# Altium project candy-box.PrjPcb
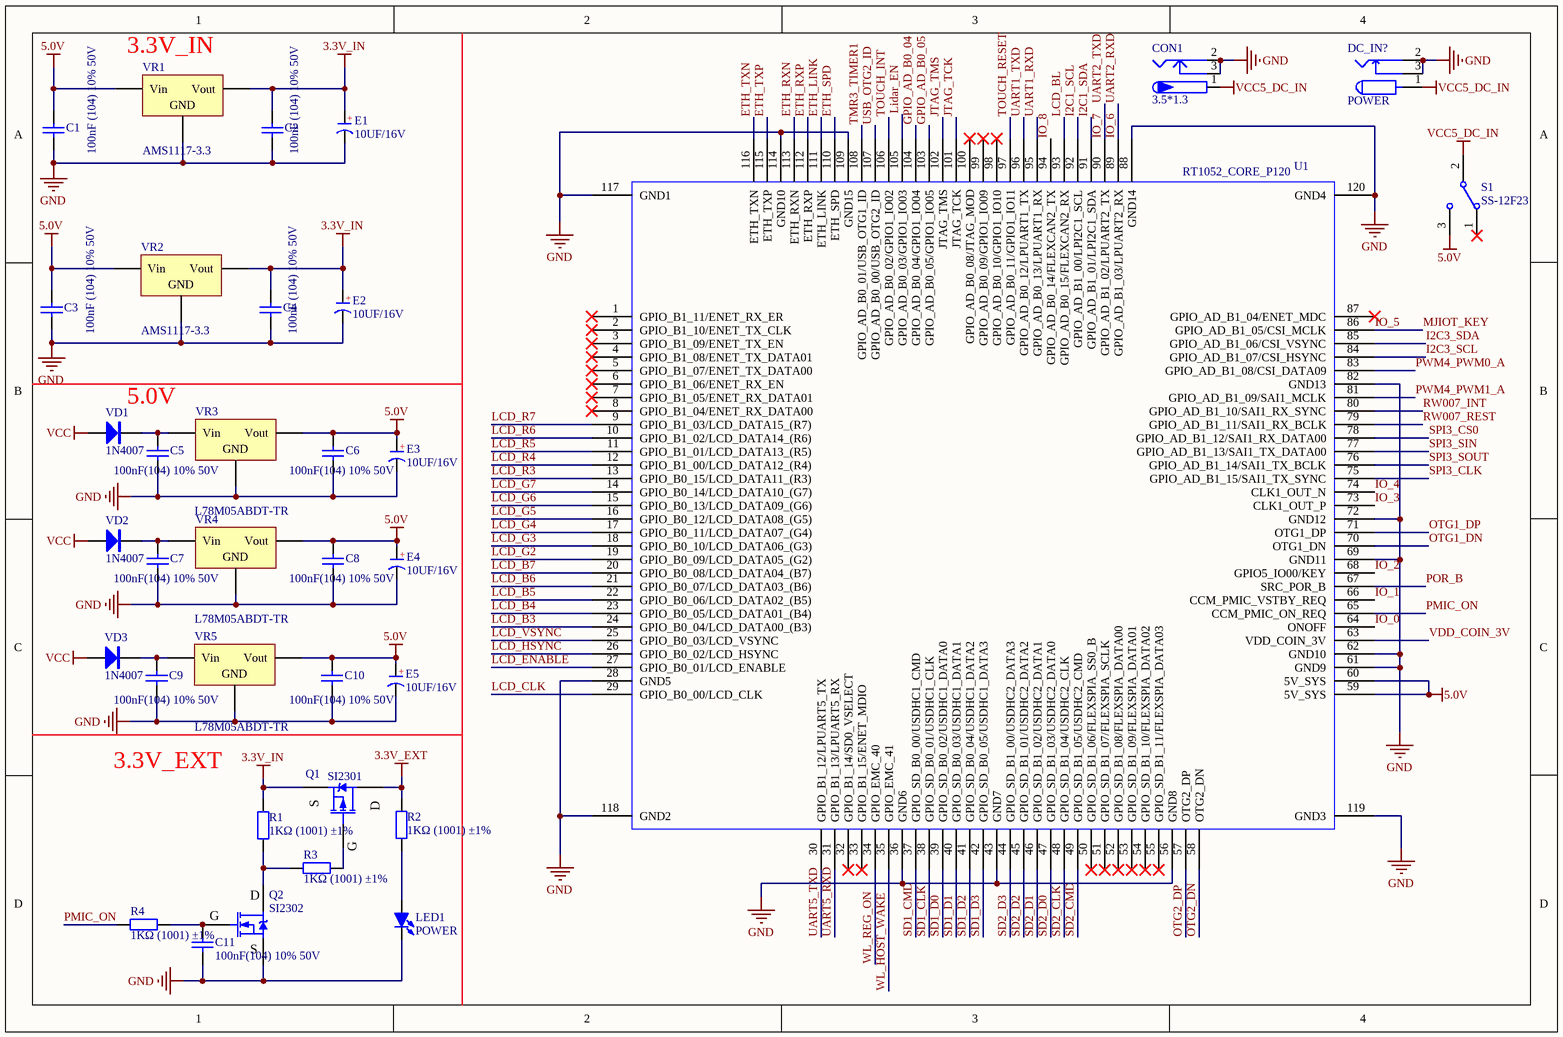
[diagram p0: Sheet1.SchDoc]
3 sheets, 131 parts. Net scope: global (net labels, ports and power ports of the same name join across sheets).
Board file: PCB1.PcbDoc
Sheets:
  Sheet1.SchDoc
  Sheet2.SchDoc
  Sheet3.SchDoc

## Sheet Sheet1.SchDoc
size A4

### Parts
C1  100nF (104) 10% 50V  [0603_C]
C2  100nF (104) 10% 50V  [0603_C]
C3  100nF (104) 10% 50V  [0603_C]
C4  100nF (104) 10% 50V  [0603_C]
C5  100nF(104) 10% 50V  [0805_C]
C6  100nF(104) 10% 50V  [0805_C]
C7  100nF(104) 10% 50V  [0805_C]
C8  100nF(104) 10% 50V  [0805_C]
C9  100nF(104) 10% 50V  [0805_C]
C10  100nF(104) 10% 50V  [0805_C]
C11  100nF(104) 10% 50V  [0805_C]
CON1  3.5*1.3  [DC-005]
DC_IN?  POWER  [DC10B]
E1  10UF/16V  [CAP 1.5*4*8]
E2  10UF/16V  [CAP 1.5*4*8]
E3  10UF/16V  [CAP 1.5*4*8 - GD]
E4  10UF/16V  [CAP 1.5*4*8 - GD]
E5  10UF/16V  [CAP 1.5*4*8 - GD]
LED1  POWER  [LED 3MM-B]
Q1  SI2301  [SOT23-3N]
Q2  SI2302  [SOT23-3N]
R1  1KΩ (1001) ±1%  [0603_R]
R2  1KΩ (1001) ±1%  [0603_R]
R3  1KΩ (1001) ±1%  [0603_R]
R4  1KΩ (1001) ±1%  [0603_R]
S1  SS-12F23  [SS-12F23]
U1  RT1052_CORE_P120  [RT1052_CORE_P120]
VD1  1N4007  [DO-41]
VD2  1N4007  [DO-41]
VD3  1N4007  [DO-41]
VR1  AMS1117-3.3  [SOT-223]
VR2  AMS1117-3.3  [SOT-223]
VR3  L78M05ABDT-TR  [TO-252-2-180]
VR4  L78M05ABDT-TR  [TO-252-2-180]
VR5  L78M05ABDT-TR  [TO-252-2-180]

### Nets
3.3V_EXT: Q1.3(D) R2.2
3.3V_IN: C2.2 C4.2 E1.1(A) E2.1(A) Q1.2(S) R1.2 VR1.2(Vout) VR2.2(Vout)
5.0V: C1.2 C3.2 C6.1 C8.1 C10.1 E3.1(A) E4.1(A) E5.1(A) S1.3 U1.59(5V_SYS) U1.60(5V_SYS) VR1.3(Vin) VR2.3(Vin) VR3.3(Vout) VR4.3(Vout) VR5.3(Vout)
GND: C1.1 C2.1 C3.1 C4.1 C5.2 C6.2 C7.2 C8.2 C9.2 C10.2 C11.2 CON1.2 CON1.3 DC_IN?.2 DC_IN?.3 E1.2(K) E2.2(K) E3.2(K) E4.2(K) E5.2(K) LED1.2(K) Q2.2(S) U1.28(GND5) U1.36(GND6) U1.43(GND7) U1.56(GND8) U1.61(GND9) U1.62(GND10) U1.69(GND11) U1.72(GND12) U1.82(GND13) U1.88(GND14) U1.109(GND15) U1.114(GND10) U1.117(GND1) U1.118(GND2) U1.119(GND3) U1.120(GND4) VR1.1(GND) VR2.1(GND) VR3.2(GND) VR4.2(GND) VR5.2(GND)
VCC: VD1.1(A) VD2.1(A) VD3.1(A)
VCC5_DC_IN: CON1.1 DC_IN?.1 S1.2
ETH_LINK: U1.111(ETH_LINK)
ETH_RXN: U1.113(ETH_RXN)
ETH_RXP: U1.112(ETH_RXP)
ETH_SPD: U1.110(ETH_SPD)
ETH_TXN: U1.116(ETH_TXN)
ETH_TXP: U1.115(ETH_TXP)
GPIO_AD_B0_04: U1.104(GPIO_AD_B0_04/GPIO1_IO04)
GPIO_AD_B0_05: U1.103(GPIO_AD_B0_05/GPIO1_IO05)
I2C1_SCL: U1.92(GPIO_AD_B1_00/LPI2C1_SCL)
I2C1_SDA: U1.91(GPIO_AD_B1_01/LPI2C1_SDA)
I2C3_SCL: U1.84(GPIO_AD_B1_07/CSI_HSYNC)
I2C3_SDA: U1.85(GPIO_AD_B1_06/CSI_VSYNC)
IO_0: U1.64(ONOFF)
IO_1: U1.66(CCM_PMIC_VSTBY_REQ)
IO_2: U1.68(GPIO5_IO00/KEY)
IO_3: U1.73(CLK1_OUT_P)
IO_4: U1.74(CLK1_OUT_N)
IO_5: U1.86(GPIO_AD_B1_05/CSI_MCLK)  [also labelled MJIOT_KEY]
IO_6: U1.89(GPIO_AD_B1_03/LPUART2_RX)  [also labelled UART2_RXD]
IO_7: U1.90(GPIO_AD_B1_02/LPUART2_TX)  [also labelled UART2_TXD]
IO_8: U1.94(GPIO_AD_B0_14/FLEXCAN2_TX)
JTAG_TCK: U1.101(JTAG_TCK)
JTAG_TMS: U1.102(JTAG_TMS)
LCD_B3: U1.24(GPIO_B0_04/LCD_DATA00_(B3))
LCD_B4: U1.23(GPIO_B0_05/LCD_DATA01_(B4))
LCD_B5: U1.22(GPIO_B0_06/LCD_DATA02_(B5))
LCD_B6: U1.21(GPIO_B0_07/LCD_DATA03_(B6))
LCD_B7: U1.20(GPIO_B0_08/LCD_DATA04_(B7))
LCD_BL: U1.93(GPIO_AD_B0_15/FLEXCAN2_RX)
LCD_CLK: U1.29(GPIO_B0_00/LCD_CLK)
LCD_ENABLE: U1.27(GPIO_B0_01/LCD_ENABLE)
LCD_G2: U1.19(GPIO_B0_09/LCD_DATA05_(G2))
LCD_G3: U1.18(GPIO_B0_10/LCD_DATA06_(G3))
LCD_G4: U1.17(GPIO_B0_11/LCD_DATA07_(G4))
LCD_G5: U1.16(GPIO_B0_12/LCD_DATA08_(G5))
LCD_G6: U1.15(GPIO_B0_13/LCD_DATA09_(G6))
LCD_G7: U1.14(GPIO_B0_14/LCD_DATA10_(G7))
LCD_HSYNC: U1.26(GPIO_B0_02/LCD_HSYNC)
LCD_R3: U1.13(GPIO_B0_15/LCD_DATA11_(R3))
LCD_R4: U1.12(GPIO_B1_00/LCD_DATA12_(R4))
LCD_R5: U1.11(GPIO_B1_01/LCD_DATA13_(R5))
LCD_R6: U1.10(GPIO_B1_02/LCD_DATA14_(R6))
LCD_R7: U1.9(GPIO_B1_03/LCD_DATA15_(R7))
LCD_VSYNC: U1.25(GPIO_B0_03/LCD_VSYNC)
Lidar_EN: U1.105(GPIO_AD_B0_03/GPIO1_IO03)
OTG1_DN: U1.70(OTG1_DN)
OTG1_DP: U1.71(OTG1_DP)
OTG2_DN: U1.58(OTG2_DN)
OTG2_DP: U1.57(OTG2_DP)
PMIC_ON: R4.2 U1.65(CCM_PMIC_ON_REQ)
POR_B: U1.67(SRC_POR_B)
PWM4_PWM0_A: U1.83(GPIO_AD_B1_08/CSI_DATA09)
PWM4_PWM1_A: U1.81(GPIO_AD_B1_09/SAI1_MCLK)
RW007_INT: U1.80(GPIO_AD_B1_10/SAI1_RX_SYNC)
RW007_REST: U1.79(GPIO_AD_B1_11/SAI1_RX_BCLK)
SD1_CLK: U1.38(GPIO_SD_B0_01/USDHC1_CLK)
SD1_CMD: U1.37(GPIO_SD_B0_00/USDHC1_CMD)
SD1_D0: U1.39(GPIO_SD_B0_02/USDHC1_DATA0)
SD1_D1: U1.40(GPIO_SD_B0_03/USDHC1_DATA1)
SD1_D2: U1.41(GPIO_SD_B0_04/USDHC1_DATA2)
SD1_D3: U1.42(GPIO_SD_B0_05/USDHC1_DATA3)
SD2_CLK: U1.48(GPIO_SD_B1_04/USDHC2_CLK)
SD2_CMD: U1.49(GPIO_SD_B1_05/USDHC2_CMD)
SD2_D0: U1.47(GPIO_SD_B1_03/USDHC2_DATA0)
SD2_D1: U1.46(GPIO_SD_B1_02/USDHC2_DATA1)
SD2_D2: U1.45(GPIO_SD_B1_01/USDHC2_DATA2)
SD2_D3: U1.44(GPIO_SD_B1_00/USDHC2_DATA3)
SPI3_CLK: U1.75(GPIO_AD_B1_15/SAI1_TX_SYNC)
SPI3_CS0: U1.78(GPIO_AD_B1_12/SAI1_RX_DATA00)
SPI3_SIN: U1.77(GPIO_AD_B1_13/SAI1_TX_DATA00)
SPI3_SOUT: U1.76(GPIO_AD_B1_14/SAI1_TX_BCLK)
TMR3_TIMER1: U1.108(GPIO_AD_B0_01/USB_OTG1_ID)
TOUCH_INT: U1.106(GPIO_AD_B0_02/GPIO1_IO02)
TOUCH_RESET: U1.97(GPIO_AD_B0_11/GPIO1_IO11)
UART1_RXD: U1.95(GPIO_AD_B0_13/LPUART1_RX)
UART1_TXD: U1.96(GPIO_AD_B0_12/LPUART1_TX)
UART5_RXD: U1.31(GPIO_B1_13/LPUART5_RX)
UART5_TXD: U1.30(GPIO_B1_12/LPUART5_TX)
USB_OTG2_ID: U1.107(GPIO_AD_B0_00/USB_OTG2_ID)
VDD_COIN_3V: U1.63(VDD_COIN_3V)
WL_HOST_WAKE: U1.35(GPIO_EMC_41)
WL_REG_ON: U1.34(GPIO_EMC_40)
NetC5_1: C5.1 VD1.2(K) VR3.1(Vin)
NetC7_1: C7.1 VD2.2(K) VR4.1(Vin)
NetC9_1: C9.1 VD3.2(K) VR5.1(Vin)
NetC11_1: C11.1 Q2.1(G) R4.1
NetLED1_1: LED1.1(A) R2.1
NetQ1_1: Q1.1(G) R3.1
NetQ2_3: Q2.3(D) R1.1 R3.2

Not connected (* = marked no-connect by the designer): S1 1*; U1 1(GPIO_B1_11/ENET_RX_ER)* 2(GPIO_B1_10/ENET_TX_CLK)* 3(GPIO_B1_09/ENET_TX_EN)* 4(GPIO_B1_08/ENET_TX_DATA01)* 5(GPIO_B1_07/ENET_TX_DATA00)* 6(GPIO_B1_06/ENET_RX_EN)* 7(GPIO_B1_05/ENET_RX_DATA01)* 8(GPIO_B1_04/ENET_RX_DATA00)* 32(GPIO_B1_14/SD0_VSELECT)* 33(GPIO_B1_15/ENET_MDIO)* 50(GPIO_SD_B1_06/FLEXSPIA_SS0_B)* 51(GPIO_SD_B1_07/FLEXSPIA_SCLK)* 52(GPIO_SD_B1_08/FLEXSPIA_DATA00)* 53(GPIO_SD_B1_09/FLEXSPIA_DATA01)* 54(GPIO_SD_B1_10/FLEXSPIA_DATA02)* 55(GPIO_SD_B1_11/FLEXSPIA_DATA03)* 87(GPIO_AD_B1_04/ENET_MDC)* 98(GPIO_AD_B0_10/GPIO1_IO10)* 99(GPIO_AD_B0_09/GPIO1_IO09)* 100(GPIO_AD_B0_08/JTAG_MOD)*

### Notes on the sheet
- (near VR1) 3.3V_IN
- 5.0V
- 3.3V_EXT
- Title
- Size:
- Date:
- A4
- Number:
- Time:
- Revision:
- Sheet
- of
- File:
- (in symbol C-CAP) +

### Library data of the parts
C1-C4 = 0603 100nF (104) 10% 50V: 贴片电容; ComponentLink1Description: 供应商链接; ComponentLink1URL: http://www.szlcsc.com/product/details_15331.html; Package: 0603; Supplier: LC; SuppliersPartNumber: C14663
C5-C11 = 0805 100nF(104) 10% 50V: 贴片电容; ComponentLink1Description: 供应商链接; ComponentLink1URL: http://www.szlcsc.com/product/details_50686.html; Package: 0805; Supplier: LC; SuppliersPartNumber: C49678
CON1 = P-DC: 低压电源接口; BOM名称: DC电源接口; 版权归属: 源创客; 学习资源: www.ooocke.com
DC_IN? = POW
E1-E5 = C-CAP: 直插电解电容; 版权归属: 源创客; BOM名称: 直插电解电容; 学习资源: www.ooocke.com
LED1 = LED-3MM: 插件LED; 版权归属: 源创客; BOM名称: 插件LED; 学习资源: www.ooocke.com
Q1 = SI2301: P沟道场效应管; 版权归属: 源创客; BOM名称: P沟道场效应管; 学习资源: www.ooocke.com
Q2 = SI2302: N沟道场效应管; 版权归属: 源创客; BOM名称: N沟道场效应管; 学习资源: www.ooocke.com
R1-R4 = 0603 1KΩ (1001) 1%: 贴片电阻; ComponentLink1Description: 供应商链接; ComponentLink1URL: http://www.szlcsc.com/product/details_21904.html; Package: 0603; Supplier: LC; SuppliersPartNumber: C21190
S1 = SSW-1P: 1路波动开关; BOM名称: 波动开关; 版权归属: 源创客; 学习资源: www.ooocke.com
VD1-VD3 = 1N4007: 整流二极管; 版权归属: 源创客; BOM名称: 整流二极管; 学习资源: www.ooocke.com
VR1 VR2 = SOT-223 AMS1117-3.3: 低压差线性稳压(LDO); ComponentLink1Description: 供应商链接; ComponentLink1URL: http://www.szlcsc.com/product/details_6652.html; Package: SOT-223; Supplier: LC; SuppliersPartNumber: C6186
VR3-VR5 = TO-252-2 L78M05ABDT-TR: 低压差线性稳压(LDO); ComponentLink1Description: 供应商链接; ComponentLink1URL: http://www.szlcsc.com/product/details_59107.html; Package: TO-252-2; Supplier: LC; SuppliersPartNumber: C58069
U1 = RT1052_CORE_P120: PCB DECAL: *; Source_Path: *; Value: *

## Sheet Sheet2.SchDoc
size A4
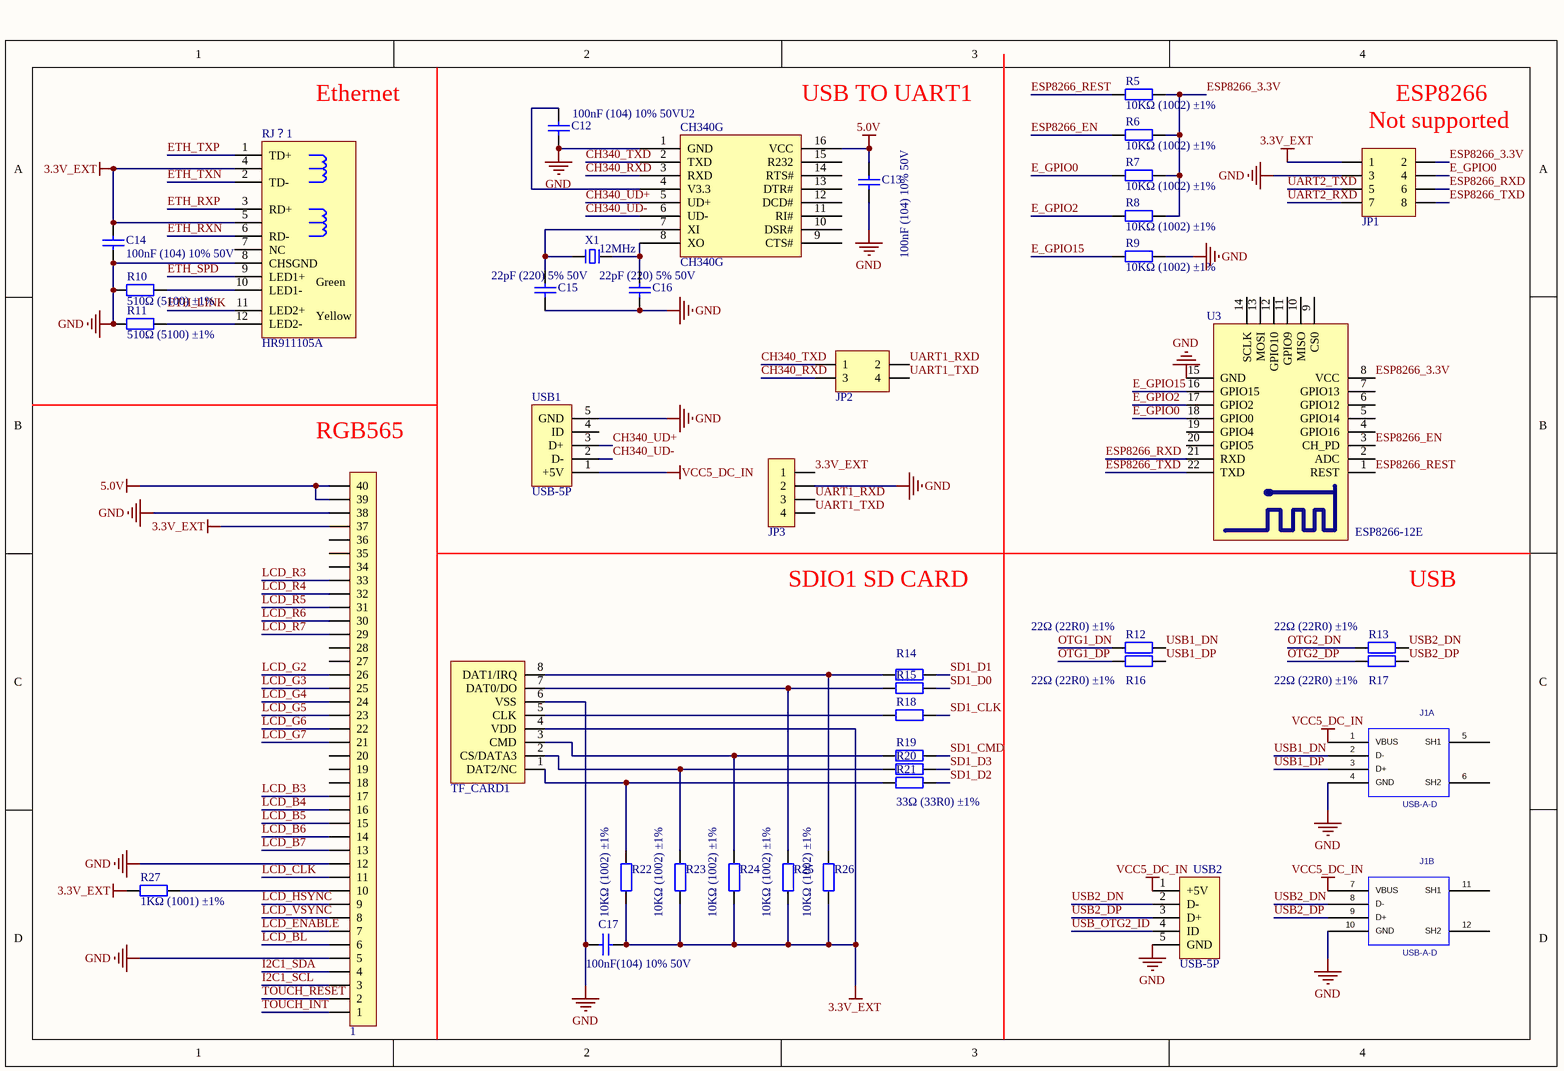
[diagram p1: Sheet2.SchDoc]

### Parts
1  FPC1.0-40P  [FPC0.5 2H-S-W-40P]  (value not drawn)
C12  100nF (104) 10% 50V  [0603_C]
C13  100nF (104) 10% 50V  [0603_C]
C14  100nF (104) 10% 50V  [0603_C]
C15  22pF (220) 5% 50V  [0603_C]
C16  22pF (220) 5% 50V  [0603_C]
C17  100nF(104) 10% 50V  [0805_C]
J1  value USB-A-D  [USB-A-D]  (hidden comment: USB-A-D_0)  (parts A,B of 2)
JP1  Header 4X2  [HDR-4X2]  (value not drawn)
JP2  Header2X2  [HDR-2X2]  (value not drawn)
JP3  HDR-1X4  [HDR-1X4_M]  (value not drawn)
R5  10KΩ (1002) ±1%  [0603_R]
R6  10KΩ (1002) ±1%  [0603_R]
R7  10KΩ (1002) ±1%  [0603_R]
R8  10KΩ (1002) ±1%  [0603_R]
R9  10KΩ (1002) ±1%  [0603_R]
R10  510Ω (5100) ±1%  [0603_R]
R11  510Ω (5100) ±1%  [0603_R]
R12  22Ω (22R0) ±1%  [0603_R]
R13  22Ω (22R0) ±1%  [0603_R]
R14  33Ω (33R0) ±1%  [0603_R]  (value not drawn)
R15  33Ω (33R0) ±1%  [0603_R]  (value not drawn)
R16  22Ω (22R0) ±1%  [0603_R]
R17  22Ω (22R0) ±1%  [0603_R]
R18  33Ω (33R0) ±1%  [0603_R]  (value not drawn)
R19  33Ω (33R0) ±1%  [0603_R]  (value not drawn)
R20  33Ω (33R0) ±1%  [0603_R]  (value not drawn)
R21  33Ω (33R0) ±1%  [0603_R]
R22  10KΩ (1002) ±1%  [0603_R]
R23  10KΩ (1002) ±1%  [0603_R]
R24  10KΩ (1002) ±1%  [0603_R]
R25  10KΩ (1002) ±1%  [0603_R]
R26  10KΩ (1002) ±1%  [0603_R]
R27  1KΩ (1001) ±1%  [0603_R]
RJ？1  HR911105A  [RJ-45A12]
TF_CARD1  SD-MICRO-TF  [SD-MICRO-TF]  (value not drawn)
U2  CH340G  [SOIC-16_150mil]
U3  ESP8266-12E  [ESP_12E]
USB1  USB-5P  [USB-MINI-A]
USB2  USB-5P  [USB-MINI-A]
X1  12MHz  [XTAL-49S DIP]

### Nets
3.3V_EXT: 1.37 C14.2 C17.1 JP1.1 JP3.1 R22.1 R23.1 R24.1 R25.1 R26.1 R27.2 RJ？1.4 RJ？1.5 TF_CARD1.4(VDD)
5.0V: 1.39 1.40 C13.1 U2.16(VCC)
GND: 1.5 1.12 1.38 C12.1 C13.2 C14.1 C15.2 C16.2 C17.2 J1.4(GND) J1.10(GND) JP1.3 JP3.2 R9.1 R10.1 R11.1 RJ？1.8(CHSGND) TF_CARD1.6(VSS) U2.1(GND) U3.15(GND) USB1.5(GND) USB2.5(GND)
VCC5_DC_IN: J1.1(VBUS) J1.7(VBUS) USB1.1(+5V) USB2.1(+5V)
CH340_RXD: JP2.3 U2.3(RXD)
CH340_TXD: JP2.1 U2.2(TXD)
CH340_UD+: U2.5(UD+) USB1.3(D+)
CH340_UD-: U2.6(UD-) USB1.2(D-)
E_GPIO0: JP1.4 R7.1 U3.18(GPIO0)
E_GPIO2: R8.1 U3.17(GPIO2)
E_GPIO15: R9.2 U3.16(GPIO15)
ESP8266_3.3V: JP1.2 R5.2 R6.2 R7.2 R8.2 U3.8(VCC)
ESP8266_EN: R6.1 U3.3(CH_PD)
ESP8266_REST: R5.1 U3.1(REST)
ESP8266_RXD: JP1.6 U3.21(RXD)
ESP8266_TXD: JP1.8 U3.22(TXD)
ETH_LINK: RJ？1.11(LED2+)
ETH_RXN: RJ？1.6(RD-)
ETH_RXP: RJ？1.3(RD+)
ETH_SPD: RJ？1.9(LED1+)
ETH_TXN: RJ？1.2(TD-)
ETH_TXP: RJ？1.1(TD+)
I2C1_SCL: 1.3
I2C1_SDA: 1.4
LCD_B3: 1.17
LCD_B4: 1.16
LCD_B5: 1.15
LCD_B6: 1.14
LCD_B7: 1.13
LCD_BL: 1.6
LCD_CLK: 1.11
LCD_ENABLE: 1.7
LCD_G2: 1.26
LCD_G3: 1.25
LCD_G4: 1.24
LCD_G5: 1.23
LCD_G6: 1.22
LCD_G7: 1.21
LCD_HSYNC: 1.9
LCD_R3: 1.33
LCD_R4: 1.32
LCD_R5: 1.31
LCD_R6: 1.30
LCD_R7: 1.29
LCD_VSYNC: 1.8
OTG1_DN: R12.1
OTG1_DP: R16.1
OTG2_DN: R13.1
OTG2_DP: R17.1
SD1_CLK: R18.2
SD1_CMD: R19.2
SD1_D0: R15.2
SD1_D1: R14.2
SD1_D2: R21.2
SD1_D3: R20.2
TOUCH_INT: 1.1
TOUCH_RESET: 1.2
UART1_RXD: JP2.2 JP3.3
UART1_TXD: JP2.4 JP3.4
UART2_RXD: JP1.7  [project net IO_6]
UART2_TXD: JP1.5  [project net IO_7]
USB1_DN: J1.2(D-) R12.2
USB1_DP: J1.3(D+) R16.2
USB2_DN: J1.8(D-) R13.2 USB2.2(D-)
USB2_DP: J1.9(D+) R17.2 USB2.3(D+)
USB_OTG2_ID: USB2.4(ID)
Net1_10: 1.10 R27.1
NetC12_2: C12.2 U2.4(V3.3)
NetC15_1: C15.1 U2.7(XI) X1.1
NetC16_1: C16.1 U2.8(XO) X1.2
NetR10_2: R10.2 RJ？1.10(LED1-)
NetR11_2: R11.2 RJ？1.12(LED2-)
NetR14_1: R14.1 R26.2 TF_CARD1.8(DAT1/IRQ)
NetR15_1: R15.1 R25.2 TF_CARD1.7(DAT0/DO)
NetR18_1: R18.1 TF_CARD1.5(CLK)
NetR19_1: R19.1 R24.2 TF_CARD1.3(CMD)
NetR20_1: R20.1 R23.2 TF_CARD1.2(CS/DATA3)
NetR21_1: R21.1 R22.2 TF_CARD1.1(DAT2/NC)

Not connected (* = marked no-connect by the designer): 1 18 19 20 27 28 34 35 36; J1 5(SH1) 6(SH2) 11(SH1) 12(SH2); RJ？1 7(NC); U2 9(CTS#) 10(DSR#) 11(RI#) 12(DCD#) 13(DTR#) 14(RTS#) 15(R232); U3 2(ADC) 4(GPIO16) 5(GPIO14) 6(GPIO12) 7(GPIO13) 9(CS0) 10(MISO) 11(GPIO9) 12(GPIO10) 13(MOSI) 14(SCLK) 19(GPIO4) 20(GPIO5); USB1 4(ID)

### Notes on the sheet
- Ethernet
- (near U2) USB TO UART1
- (near JP1) Not supported
- ESP8266
- (near 1) RGB565
- SDIO1 SD CARD
- USB
- Title
- Size:
- Date:
- A4
- Number:
- Time:
- Revision:
- Sheet
- of
- File:
- (in symbol HR911105A) Green; Yellow

### Library data of the parts
1 = FPC-40P: FPC连接器; 版权归属: 源创客; BOM名称: FPC连接器; 学习资源: www.ooocke.com
C12-C14 = 0603 100nF (104) 10% 50V: 贴片电容; ComponentLink1Description: 供应商链接; ComponentLink1URL: http://www.szlcsc.com/product/details_15331.html; Package: 0603; Supplier: LC; SuppliersPartNumber: C14663
C15 C16 = 0805 22pF (220) 5% 50V: 贴片电容; ComponentLink1Description: 供应商链接; ComponentLink1URL: http://www.szlcsc.com/product/details_2156.html; Package: 0805; Supplier: LC; SuppliersPartNumber: C1804
C17 = 0805 100nF(104) 10% 50V: 贴片电容; ComponentLink1Description: 供应商链接; ComponentLink1URL: http://www.szlcsc.com/product/details_50686.html; Package: 0805; Supplier: LC; SuppliersPartNumber: C49678
J1 = USB-A-D_0: Source_Path: D:\NXP_RT1050\RT1050_MB_PRO\SCH\IMXRT1052_MB_PRO_0313.DSN; PCB DECAL: USB-A-D
JP1 = Header 4X2: 4*2P接插件; 版权归属: 源创客; BOM名称: 4*2P接插件; 学习资源: www.ooocke.com
JP2 = Header 2X2: 2*2P接插件; 版权归属: 源创客; BOM名称: 2*2P接插件; 学习资源: www.ooocke.com
JP3 = Header 4: 4P接插件; 版权归属: 源创客; BOM名称: 4P接插件; 学习资源: www.ooocke.com
R5-R9 R22-R26 = 0603 10KΩ (1002) 1%: 贴片电阻; ComponentLink1Description: 供应商链接; ComponentLink1URL: http://www.szlcsc.com/product/details_26547.html; Package: 0603; Supplier: LC; SuppliersPartNumber: C25804
R10 R11 = 0603 510Ω (5100) 1%: 贴片电阻; ComponentLink1Description: 供应商链接; ComponentLink1URL: http://www.szlcsc.com/product/details_23920.html; Package: 0603; Supplier: LC; SuppliersPartNumber: C23193
R12 R13 R16 R17 = 0603 22Ω (22R0) 1%: 贴片电阻; ComponentLink1Description: 供应商链接; ComponentLink1URL: http://www.szlcsc.com/product/details_24078.html; Package: 0603; Supplier: LC; SuppliersPartNumber: C23345
R14 R15 R18-R21 = 0603 33Ω (33R0) 1%: 贴片电阻; ComponentLink1Description: 供应商链接; ComponentLink1URL: http://www.szlcsc.com/product/details_23867.html; Package: 0603; Supplier: LC; SuppliersPartNumber: C23140
R27 = 0603 1KΩ (1001) 1%: 贴片电阻; ComponentLink1Description: 供应商链接; ComponentLink1URL: http://www.szlcsc.com/product/details_21904.html; Package: 0603; Supplier: LC; SuppliersPartNumber: C21190
RJ？1 = HR911105A: 带灯以太网接口; 版权归属: 源创客; BOM名称: 带灯以太网接口; 学习资源: www.ooocke.com
TF_CARD1 = SD-MICRO-TF: SD,MICRO,TF
U2 = CH340G_[C14267]: USB; ComponentLink1Description: 供应商链接; ComponentLink1URL: http://www.szlcsc.com/product/details_14927.html; Package: SOIC-16_150mil; Supplier: LC; SuppliersPartNumber: C14267
U3 = ESP8266-12E: 串口 WIFI模块，ESP-12E; BOM名称: WIFI模块; 版权归属: 源创客; 学习资源: www.ooocke.com
USB1 USB2 = USB-5P: 微型USB母座; 版权归属: 源创客; BOM名称: 微型USB母座; 学习资源: www.ooocke.com
X1 = XTAL-2: 2脚晶振; 版权归属: 源创客; BOM名称: 2脚晶振; 学习资源: www.ooocke.com

## Sheet Sheet3.SchDoc: https://github.com/balanceTWK/candy-box
size A4; Author: https://github.com/balanceTWK/candy-box; DrawnBy: https://github.com/balanceTWK/candy-box
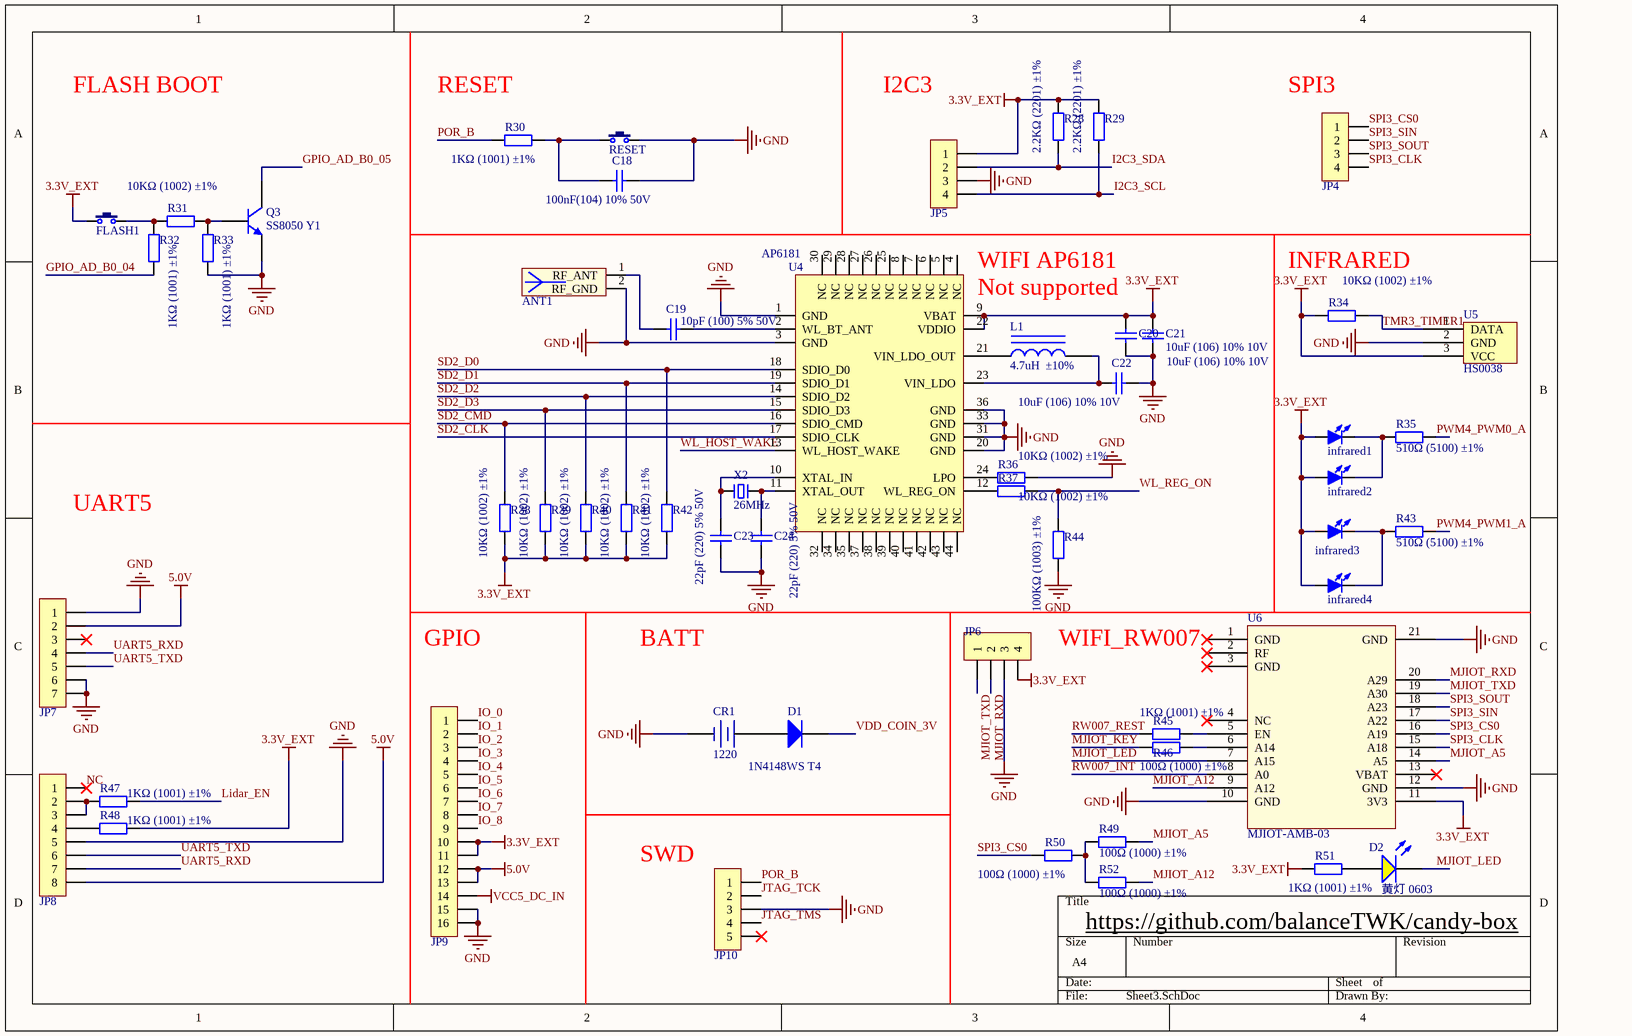
[diagram p2: Sheet3.SchDoc]

### Parts
ANT1  ANT-2.4G  [ANT-2.4G]  (value not drawn)
C18  100nF(104) 10% 50V  [0805_C]
C19  10pF (100) 5% 50V  [0603_C]
C20  10uF (106) 10% 10V  [0603_C]
C21  10uF (106) 10% 10V  [0603_C]
C22  10uF (106) 10% 10V  [0603_C]
C23  22pF (220) 5% 50V  [0603_C]
C24  22pF (220) 5% 50V  [0603_C]
CR1  1220  [CR1220_B]
D1  1N4148WS T4  [SOD-323]
D2  黄灯 0603  [0603_LED_S1]
FLASH1  6x6x5  [TSW DIP-6*6*6_V]  (value not drawn)
infrared1  红色  [LED 3MM-R]  (value not drawn)
infrared2  红色  [LED 3MM-R]  (value not drawn)
infrared3  红色  [LED 3MM-R]  (value not drawn)
infrared4  红色  [LED 3MM-R]  (value not drawn)
JP4  HDR-1X4  [HDR-1X4]  (value not drawn)
JP5  HDR-1X4  [HDR-1X4_M]  (value not drawn)
JP6  HDR-1X4  [HDR-1X4]  (value not drawn)
JP7  HDR-1X7  [HDR-1X7_M]  (value not drawn)
JP8  HDR-1X8  [PH2.0 D-W-8P]  (value not drawn)
JP9  HDR-1X16  [HDR-1X16]  (value not drawn)
JP10  HDR-1X5  [XH2.54-5P]  (value not drawn)
L1  4.7uH  ±10%  [1206_L]
Q3  SS8050 Y1  [SOT-23(SOT-23-3)]
R28  2.2KΩ (2201) ±1%  [0603_R]
R29  2.2KΩ (2201) ±1%  [0603_R]
R30  1KΩ (1001) ±1%  [0603_R]
R31  10KΩ (1002) ±1%  [0603_R]
R32  1KΩ (1001) ±1%  [0603_R]
R33  1KΩ (1001) ±1%  [0603_R]
R34  10KΩ (1002) ±1%  [0603_R]
R35  510Ω (5100) ±1%  [0603_R]
R36  10KΩ (1002) ±1%  [0603_R]
R37  10KΩ (1002) ±1%  [0603_R]
R38  10KΩ (1002) ±1%  [0603_R]
R39  10KΩ (1002) ±1%  [0603_R]
R40  10KΩ (1002) ±1%  [0603_R]
R41  10KΩ (1002) ±1%  [0603_R]
R42  10KΩ (1002) ±1%  [0603_R]
R43  510Ω (5100) ±1%  [0603_R]
R44  100KΩ (1003) ±1%  [0603_R]
R45  1KΩ (1001) ±1%  [0603_R]
R46  100Ω (1000) ±1%  [0603_R]
R47  1KΩ (1001) ±1%  [0603_R]
R48  1KΩ (1001) ±1%  [0603_R]
R49  100Ω (1000) ±1%  [0603_R]
R50  100Ω (1000) ±1%  [0603_R]
R51  1KΩ (1001) ±1%  [0603_R]
R52  100Ω (1000) ±1%  [0603_R]
RESET  6x6x5  [TSW DIP-6*6*6_V]  (value not drawn)
U4  AP6181  [QFN-44]
U5  HS0038  [HS0038]
U6  MJIOT-AMB-03  [20PIN-MODULE-PLATFORM_DEBUG-01]
X2  26MHz  [XTAL-49S DIP]

### Nets
3.3V_EXT: C20.2 C21.2 FLASH1.1 infrared1.1(A) infrared2.1(A) infrared3.1(A) infrared4.1(A) JP5.1 JP6.4 JP9.10 JP9.11 R28.2 R29.2 R34.2 R38.1 R39.1 R40.1 R41.1 R42.1 R48.2 R51.1 U4.9(VBAT) U4.22(VDDIO) U5.3(VCC) U6.11(3V3)
5.0V: JP7.2 JP8.8 JP9.12 JP9.13
GND: ANT1.2(RF_GND) C18.2 C20.1 C21.1 C22.2 C23.2 C24.2 CR1.2(DC-) JP5.3 JP6.3 JP7.1 JP7.6 JP7.7 JP8.5 JP9.15 JP9.16 JP10.3 Q3.2(E) R33.1 R36.1 R44.1 RESET.2 U4.1(GND) U4.3(GND) U4.20(GND) U4.31(GND) U4.33(GND) U4.36(GND) U5.2(GND) U6.10(GND) U6.12(GND) U6.21(GND)
VCC5_DC_IN: JP9.14
GPIO_AD_B0_04: R32.1
GPIO_AD_B0_05: Q3.3(C)
I2C3_SCL: JP5.4 R29.1
I2C3_SDA: JP5.2 R28.1
IO_0: JP9.1
IO_1: JP9.2
IO_2: JP9.3
IO_3: JP9.4
IO_4: JP9.5
IO_5: JP9.6 R46.1  [also labelled MJIOT_KEY]
IO_6: JP9.7
IO_7: JP9.8
IO_8: JP9.9
JTAG_TCK: JP10.2
JTAG_TMS: JP10.4
Lidar_EN: R47.2
MJIOT_A5: R49.2 U6.14(A5)
MJIOT_A12: R52.2 U6.9(A12)
MJIOT_LED: D2.K U6.7(A15)
MJIOT_RXD: JP6.2 U6.20(A29)
MJIOT_TXD: JP6.1 U6.19(A30)
NC: JP8.1
POR_B: JP10.1 R30.2
PWM4_PWM0_A: R35.2
PWM4_PWM1_A: R43.2
RW007_INT: U6.8(A0)
RW007_REST: R45.1
SD2_CLK: U4.17(SDIO_CLK)
SD2_CMD: R38.2 U4.16(SDIO_CMD)
SD2_D0: R42.2 U4.18(SDIO_D0)
SD2_D1: R41.2 U4.19(SDIO_D1)
SD2_D2: R40.2 U4.14(SDIO_D2)
SD2_D3: R39.2 U4.15(SDIO_D3)
SPI3_CLK: JP4.4 U6.15(A18)
SPI3_CS0: JP4.1 R50.1 U6.16(A19)
SPI3_SIN: JP4.2 U6.17(A22)
SPI3_SOUT: JP4.3 U6.18(A23)
TMR3_TIMER1: R34.1 U5.1(DATA)
UART5_RXD: JP7.4 JP8.7
UART5_TXD: JP7.5 JP8.6
VDD_COIN_3V: D1.2(K)
WL_HOST_WAKE: U4.13(WL_HOST_WAKE)
WL_REG_ON: R37.1 R44.2
NetANT1_1: ANT1.1(RF_ANT) C19.1
NetC18_1: C18.1 R30.1 RESET.1
NetC19_2: C19.2 U4.2(WL_BT_ANT)
NetC22_1: C22.1 L1.2 U4.23(VIN_LDO)
NetC23_1: C23.1 U4.10(XTAL_IN) X2.1
NetC24_1: C24.1 U4.11(XTAL_OUT) X2.2
NetCR1_1: CR1.1(DC+) D1.1(A)
NetD2_A: D2.A R51.2
NetFLASH1_2: FLASH1.2 R31.1 R32.2
Netinfrared1_2: infrared1.2(K) infrared2.2(K) R35.1
Netinfrared3_2: infrared3.2(K) infrared4.2(K) R43.1
NetJP8_2: JP8.2 JP8.3 R47.1
NetJP8_4: JP8.4 R48.1
NetL1_1: L1.1 U4.21(VIN_LDO_OUT)
NetQ3_1: Q3.1(B) R31.2 R33.2
NetR36_2: R36.2 U4.24(LPO)
NetR37_2: R37.2 U4.12(WL_REG_ON)
NetR45_2: R45.2 U6.5(EN)
NetR46_2: R46.2 U6.6(A14)
NetR49_1: R49.1 R50.2 R52.1

Not connected (* = marked no-connect by the designer): JP7 3*; JP10 5*; U4 4(NC) 5(NC) 6(NC) 7(NC) 8(NC) 25(NC) 26(NC) 27(NC) 28(NC) 29(NC) 30(NC) 32(NC) 34(NC) 35(NC) 37(NC) 38(NC) 39(NC) 40(NC) 41(NC) 42(NC) 43(NC) 44(NC); U6 1(GND)* 2(RF)* 3(GND)* 4(NC)* 13(VBAT)*

### Notes on the sheet
- FLASH BOOT
- (near R30) RESET
- I2C3
- (near JP4) SPI3
- (near U4) WIFI AP6181
- (near U4) Not supported
- (near R34) INFRARED
- UART5
- GPIO
- BATT
- (near JP6) WIFI_RW007
- SWD
- https://github.com/balanceTWK/candy-box

### Library data of the parts
ANT1 = ANT-2.4G: ANT,2.4G,PCB天线
C18 = 0805 100nF(104) 10% 50V: 贴片电容; ComponentLink1Description: 供应商链接; ComponentLink1URL: http://www.szlcsc.com/product/details_50686.html; Package: 0805; Supplier: LC; SuppliersPartNumber: C49678
C19 = 0603 10pF (100) 5% 50V: 贴片电容; ComponentLink1Description: 供应商链接; ComponentLink1URL: http://www.szlcsc.com/product/details_1986.html; Package: 0603; Supplier: LC; SuppliersPartNumber: C1634
C20-C22 = 0603 10uF (106) 10% 10V: 贴片电容; ComponentLink1Description: 供应商链接; ComponentLink1URL: http://www.szlcsc.com/product/details_20411.html; Package: 0603; Supplier: LC; SuppliersPartNumber: C19702
C23 C24 = 0603 22pF (220) 5% 50V: 贴片电容; ComponentLink1Description: 供应商链接; ComponentLink1URL: http://www.szlcsc.com/product/details_2005.html; Package: 0603; Supplier: LC; SuppliersPartNumber: C1653
CR1 = CR-3V: 微型电池; 版权归属: 源创客; BOM名称: 微型电池; 学习资源: www.ooocke.com
D1 = SOD-323 1N4148WS T4: 二极管; ComponentLink1Description: 供应商链接; ComponentLink1URL: http://www.szlcsc.com/product/details_2485.html; Package: SOD-323; Supplier: LC; SuppliersPartNumber: C2128
D2 = 0603 黄灯: 发光二极管; ComponentLink1Description: 供应商链接; ComponentLink1URL: http://www.szlcsc.com/product/details_73147.html; Package: 0603; Supplier: LC; SuppliersPartNumber: C72038
FLASH1 RESET = TSW DIP-6x6_V: 侧按直插6x6轻触开关; 版权归属: 源创客; BOM名称: 直插6x6轻触开关; 学习资源: www.ooocke.com
infrared1-infrared4 = LED-3MM: 插件LED; 版权归属: 源创客; BOM名称: 插件LED; 学习资源: www.ooocke.com
JP4-JP6 = Header 4: 4P接插件; 版权归属: 源创客; BOM名称: 4P接插件; 学习资源: www.ooocke.com
JP7 = Header 7: 7P接插件; 版权归属: 源创客; BOM名称: 7P接插件; 学习资源: www.ooocke.com
JP8 = Header 8: 8P接插件; 版权归属: 源创客; BOM名称: 8P接插件; 学习资源: www.ooocke.com
JP9 = Header 16: 16P接插件; 版权归属: 源创客; BOM名称: 16P接插件; 学习资源: www.ooocke.com
JP10 = Header 5: 5P接插件; 版权归属: 源创客; BOM名称: 5P接插件; 学习资源: www.ooocke.com
L1 = 1206 4.7uH  10%: 贴片电感; ComponentLink1Description: 供应商链接; ComponentLink1URL: http://www.szlcsc.com/product/details_1401.html; Package: 1206; Supplier: LC; SuppliersPartNumber: C1049
Q3 = SOT-23 SS8050 Y1: 三极管; ComponentLink1Description: 供应商链接; ComponentLink1URL: http://www.szlcsc.com/product/details_2507.html; Package: SOT-23; Supplier: LC; SuppliersPartNumber: C2150
R28 R29 = 0603 2.2KΩ (2201) 1%: 贴片电阻; ComponentLink1Description: 供应商链接; ComponentLink1URL: http://www.szlcsc.com/product/details_4597.html; Package: 0603; Supplier: LC; SuppliersPartNumber: C4190
R30 R32 R33 R45 R47 R48 R51 = 0603 1KΩ (1001) 1%: 贴片电阻; ComponentLink1Description: 供应商链接; ComponentLink1URL: http://www.szlcsc.com/product/details_21904.html; Package: 0603; Supplier: LC; SuppliersPartNumber: C21190
R31 R34 R36-R42 = 0603 10KΩ (1002) 1%: 贴片电阻; ComponentLink1Description: 供应商链接; ComponentLink1URL: http://www.szlcsc.com/product/details_26547.html; Package: 0603; Supplier: LC; SuppliersPartNumber: C25804
R35 R43 = 0603 510Ω (5100) 1%: 贴片电阻; ComponentLink1Description: 供应商链接; ComponentLink1URL: http://www.szlcsc.com/product/details_23920.html; Package: 0603; Supplier: LC; SuppliersPartNumber: C23193
R44 = 0603 100KΩ (1003) 1%: 贴片电阻; ComponentLink1Description: 供应商链接; ComponentLink1URL: http://www.szlcsc.com/product/details_26546.html; Package: 0603; Supplier: LC; SuppliersPartNumber: C25803
R46 R49 R50 R52 = 0603 100Ω (1000) 1%: 贴片电阻; ComponentLink1Description: 供应商链接; ComponentLink1URL: http://www.szlcsc.com/product/details_23502.html; Package: 0603; Supplier: LC; SuppliersPartNumber: C22775
U4 = U-AP6181: WIFI Module,SDIO
X2 = XTAL-2: 2脚晶振; 版权归属: 源创客; BOM名称: 2脚晶振; 学习资源: www.ooocke.com

## Nets that join several sheets
3.3V_EXT: Sheet1 (Q1.3 R2.2), Sheet2 (14 pins), Sheet3 (25 pins)
5.0V: Sheet1 (16 pins), Sheet2 (1.39 1.40 C13.1 U2.16), Sheet3 (JP7.2 JP8.8 JP9.12 JP9.13)
GND: Sheet1 (43 pins), Sheet2 (22 pins), Sheet3 (32 pins)
VCC5_DC_IN: Sheet1 (CON1.1 DC_IN?.1 S1.2), Sheet2 (J1.1 J1.7 USB1.1 USB2.1), Sheet3 (JP9.14)
ETH_LINK: Sheet1 (U1.111), Sheet2 (RJ？1.11)
ETH_RXN: Sheet1 (U1.113), Sheet2 (RJ？1.6)
ETH_RXP: Sheet1 (U1.112), Sheet2 (RJ？1.3)
ETH_SPD: Sheet1 (U1.110), Sheet2 (RJ？1.9)
ETH_TXN: Sheet1 (U1.116), Sheet2 (RJ？1.2)
ETH_TXP: Sheet1 (U1.115), Sheet2 (RJ？1.1)
GPIO_AD_B0_04: Sheet1 (U1.104), Sheet3 (R32.1)
GPIO_AD_B0_05: Sheet1 (U1.103), Sheet3 (Q3.3)
I2C1_SCL: Sheet1 (U1.92), Sheet2 (1.3)
I2C1_SDA: Sheet1 (U1.91), Sheet2 (1.4)
I2C3_SCL: Sheet1 (U1.84), Sheet3 (JP5.4 R29.1)
I2C3_SDA: Sheet1 (U1.85), Sheet3 (JP5.2 R28.1)
IO_0: Sheet1 (U1.64), Sheet3 (JP9.1)
IO_1: Sheet1 (U1.66), Sheet3 (JP9.2)
IO_2: Sheet1 (U1.68), Sheet3 (JP9.3)
IO_3: Sheet1 (U1.73), Sheet3 (JP9.4)
IO_4: Sheet1 (U1.74), Sheet3 (JP9.5)
IO_5: Sheet1 (U1.86), Sheet3 (JP9.6 R46.1)
IO_6: Sheet1 (U1.89), Sheet2 (JP1.7), Sheet3 (JP9.7)
IO_7: Sheet1 (U1.90), Sheet2 (JP1.5), Sheet3 (JP9.8)
IO_8: Sheet1 (U1.94), Sheet3 (JP9.9)
JTAG_TCK: Sheet1 (U1.101), Sheet3 (JP10.2)
JTAG_TMS: Sheet1 (U1.102), Sheet3 (JP10.4)
LCD_B3: Sheet1 (U1.24), Sheet2 (1.17)
LCD_B4: Sheet1 (U1.23), Sheet2 (1.16)
LCD_B5: Sheet1 (U1.22), Sheet2 (1.15)
LCD_B6: Sheet1 (U1.21), Sheet2 (1.14)
LCD_B7: Sheet1 (U1.20), Sheet2 (1.13)
LCD_BL: Sheet1 (U1.93), Sheet2 (1.6)
LCD_CLK: Sheet1 (U1.29), Sheet2 (1.11)
LCD_ENABLE: Sheet1 (U1.27), Sheet2 (1.7)
LCD_G2: Sheet1 (U1.19), Sheet2 (1.26)
LCD_G3: Sheet1 (U1.18), Sheet2 (1.25)
LCD_G4: Sheet1 (U1.17), Sheet2 (1.24)
LCD_G5: Sheet1 (U1.16), Sheet2 (1.23)
LCD_G6: Sheet1 (U1.15), Sheet2 (1.22)
LCD_G7: Sheet1 (U1.14), Sheet2 (1.21)
LCD_HSYNC: Sheet1 (U1.26), Sheet2 (1.9)
LCD_R3: Sheet1 (U1.13), Sheet2 (1.33)
LCD_R4: Sheet1 (U1.12), Sheet2 (1.32)
LCD_R5: Sheet1 (U1.11), Sheet2 (1.31)
LCD_R6: Sheet1 (U1.10), Sheet2 (1.30)
LCD_R7: Sheet1 (U1.9), Sheet2 (1.29)
LCD_VSYNC: Sheet1 (U1.25), Sheet2 (1.8)
Lidar_EN: Sheet1 (U1.105), Sheet3 (R47.2)
OTG1_DN: Sheet1 (U1.70), Sheet2 (R12.1)
OTG1_DP: Sheet1 (U1.71), Sheet2 (R16.1)
OTG2_DN: Sheet1 (U1.58), Sheet2 (R13.1)
OTG2_DP: Sheet1 (U1.57), Sheet2 (R17.1)
POR_B: Sheet1 (U1.67), Sheet3 (JP10.1 R30.2)
PWM4_PWM0_A: Sheet1 (U1.83), Sheet3 (R35.2)
PWM4_PWM1_A: Sheet1 (U1.81), Sheet3 (R43.2)
RW007_INT: Sheet1 (U1.80), Sheet3 (U6.8)
RW007_REST: Sheet1 (U1.79), Sheet3 (R45.1)
SD1_CLK: Sheet1 (U1.38), Sheet2 (R18.2)
SD1_CMD: Sheet1 (U1.37), Sheet2 (R19.2)
SD1_D0: Sheet1 (U1.39), Sheet2 (R15.2)
SD1_D1: Sheet1 (U1.40), Sheet2 (R14.2)
SD1_D2: Sheet1 (U1.41), Sheet2 (R21.2)
SD1_D3: Sheet1 (U1.42), Sheet2 (R20.2)
SD2_CLK: Sheet1 (U1.48), Sheet3 (U4.17)
SD2_CMD: Sheet1 (U1.49), Sheet3 (R38.2 U4.16)
SD2_D0: Sheet1 (U1.47), Sheet3 (R42.2 U4.18)
SD2_D1: Sheet1 (U1.46), Sheet3 (R41.2 U4.19)
SD2_D2: Sheet1 (U1.45), Sheet3 (R40.2 U4.14)
SD2_D3: Sheet1 (U1.44), Sheet3 (R39.2 U4.15)
SPI3_CLK: Sheet1 (U1.75), Sheet3 (JP4.4 U6.15)
SPI3_CS0: Sheet1 (U1.78), Sheet3 (JP4.1 R50.1 U6.16)
SPI3_SIN: Sheet1 (U1.77), Sheet3 (JP4.2 U6.17)
SPI3_SOUT: Sheet1 (U1.76), Sheet3 (JP4.3 U6.18)
TMR3_TIMER1: Sheet1 (U1.108), Sheet3 (R34.1 U5.1)
TOUCH_INT: Sheet1 (U1.106), Sheet2 (1.1)
TOUCH_RESET: Sheet1 (U1.97), Sheet2 (1.2)
UART1_RXD: Sheet1 (U1.95), Sheet2 (JP2.2 JP3.3)
UART1_TXD: Sheet1 (U1.96), Sheet2 (JP2.4 JP3.4)
UART5_RXD: Sheet1 (U1.31), Sheet3 (JP7.4 JP8.7)
UART5_TXD: Sheet1 (U1.30), Sheet3 (JP7.5 JP8.6)
USB_OTG2_ID: Sheet1 (U1.107), Sheet2 (USB2.4)
VDD_COIN_3V: Sheet1 (U1.63), Sheet3 (D1.2)
WL_HOST_WAKE: Sheet1 (U1.35), Sheet3 (U4.13)
WL_REG_ON: Sheet1 (U1.34), Sheet3 (R37.1 R44.2)